# EAGLE schematic TommyPROM-uno (EAGLE 9.3.0)
Tom's EEPROM programmer hosted on Arduino Uno.
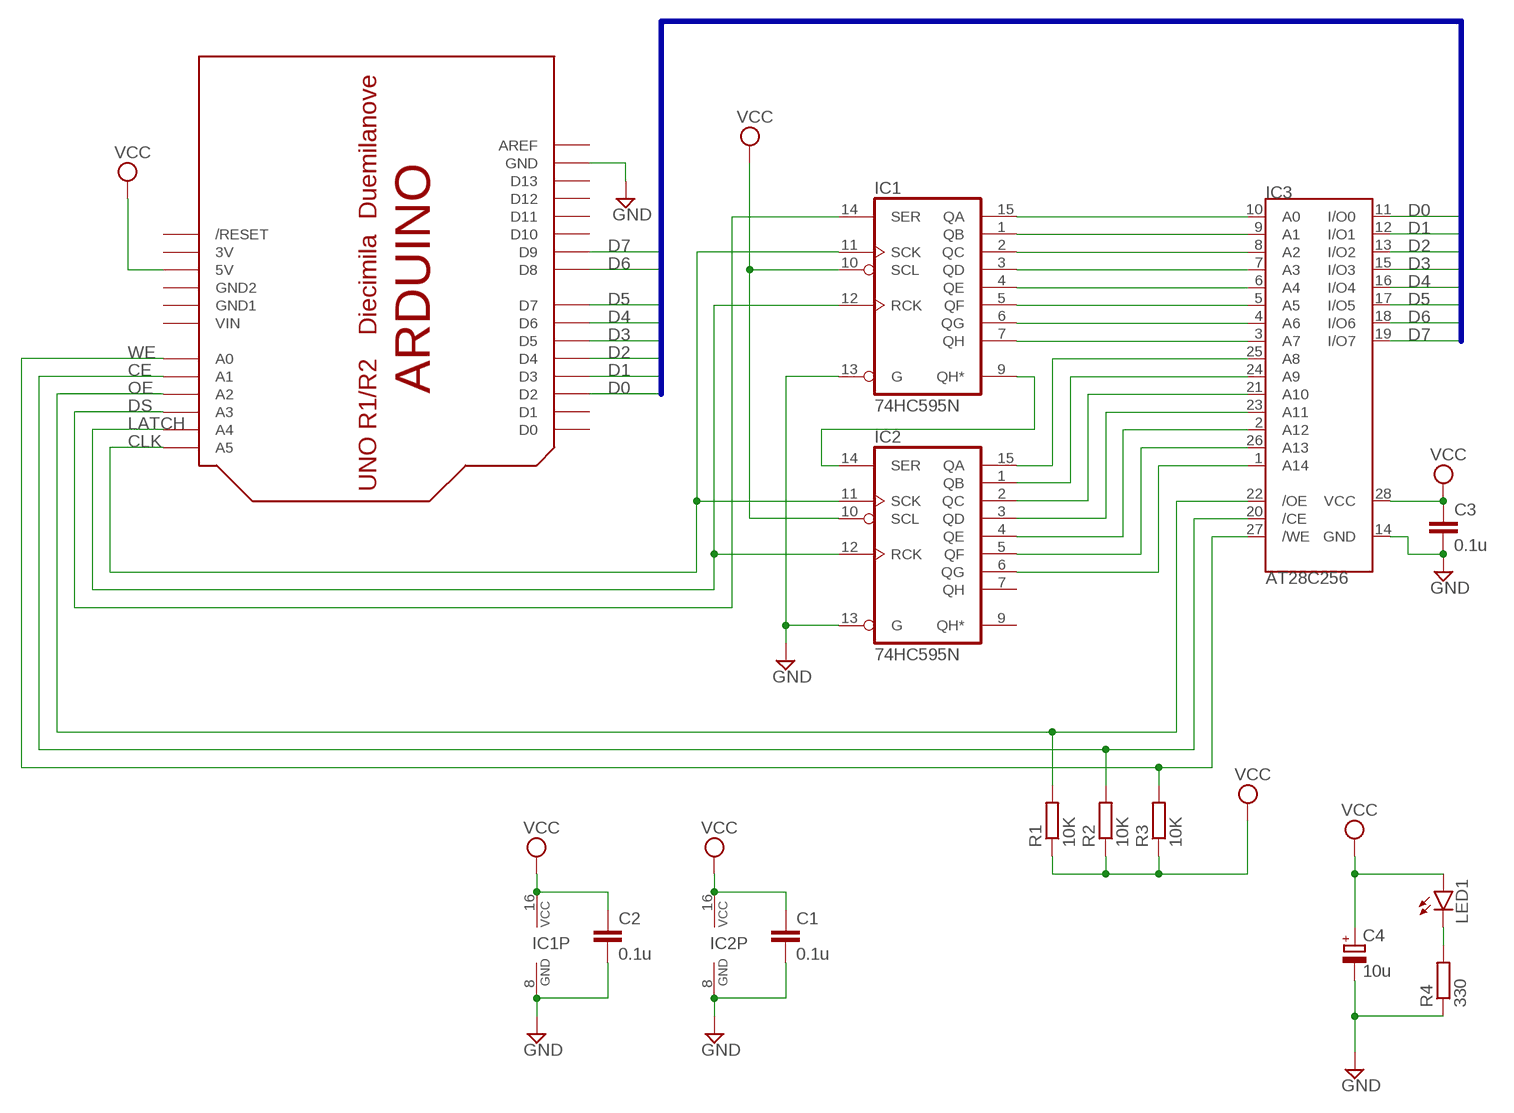
[diagram p0: schematic, sheet 1]

## Parts
C1  0.1u  C-EU025-025X050  [C025-025X050]
C2  0.1u  C-EU025-025X050  [C025-025X050]
C3  0.1u  C-EU025-025X050  [C025-025X050]
C4  10u  CPOL-EUE2-5  [E2-5]
IC1  74HC595N  [DIL16]
IC2  74HC595N  [DIL16]
IC3  AT28C256  AT28C256-28DIP  [DIL28-6]
LED1  LED5MM  [LED5MM]
R1  10K  R-EU_0204/7  [0204/7]
R2  10K  R-EU_0204/7  [0204/7]
R3  10K  R-EU_0204/7  [0204/7]
R4  330  R-EU_0204/7  [0204/7]
U$1  ARDUINO-BPLACE  [ARDUINO-BPLACE]

## Nets
CE: IC3.20(/CE) R2.2 U$1.A1
CLK: IC1.11(SCK) IC2.11(SCK) U$1.A5
D0: IC3.11(I/O0) U$1.D2
D1: IC3.12(I/O1) U$1.D3
D2: IC3.13(I/O2) U$1.D4
D3: IC3.15(I/O3) U$1.D5
D4: IC3.16(I/O4) U$1.D6
D5: IC3.17(I/O5) U$1.D7
D6: IC3.18(I/O6) U$1.D8
D7: IC3.19(I/O7) U$1.D9
DS: IC1.14(SER) U$1.A3
GND: C1.2 C2.2 C3.2 C4.- IC1.8(GND) IC1.13(G) IC2.8(GND) IC2.13(G) IC3.14(GND) R4.1 U$1.GND
LATCH: IC1.12(RCK) IC2.12(RCK) U$1.A4
N$1: IC1.9(QH*) IC2.14(SER)
N$2: LED1.K(C) R4.2
N$6: IC2.6(QG) IC3.1(A14)
N$7: IC2.5(QF) IC3.26(A13)
N$8: IC2.4(QE) IC3.2(A12)
N$9: IC2.3(QD) IC3.23(A11)
N$10: IC2.2(QC) IC3.21(A10)
N$15: IC2.1(QB) IC3.24(A9)
N$16: IC2.15(QA) IC3.25(A8)
N$17: IC1.7(QH) IC3.3(A7)
N$18: IC1.6(QG) IC3.4(A6)
N$19: IC1.5(QF) IC3.5(A5)
N$20: IC1.4(QE) IC3.6(A4)
N$21: IC1.3(QD) IC3.7(A3)
N$22: IC1.2(QC) IC3.8(A2)
N$23: IC1.1(QB) IC3.9(A1)
N$24: IC1.15(QA) IC3.10(A0)
OE: IC3.22(/OE) R1.2 U$1.A2
VCC: C1.1 C2.1 C3.1 C4.+ IC1.10(SCL) IC1.16(VCC) IC2.10(SCL) IC2.16(VCC) IC3.28(VCC) LED1.A R1.1 R2.1 R3.1 U$1.5V
WE: IC3.27(/WE) R3.2 U$1.A0
Unconnected: IC2.7(QH) IC2.9(QH*) U$1.AREF U$1.D0 U$1.D1 U$1.D10 U$1.D11 U$1.D12 U$1.D13 U$1.RESET(/RESET)

## Buses
D[0..7]

## Power pins joined to a net without a drawn wire
3V: U$1.3V
GND1: U$1.GND1
GND2: U$1.GND2
VIN: U$1.VIN

## Library data of the parts
C1-C3 = rcl:C-EU: CAPACITOR, European symbol; SPICEPREFIX: C
C4 = rcl:CPOL-EU: POLARIZED CAPACITOR, European symbol; SPICEPREFIX: C
IC1 IC2 = 74xx-eu:74*595: 8-bit SHIFT REGISTER, output latch
IC3 = mylib_memory:AT28C256-28DIP: IC EEPROM 256KBIT 28DIP
LED1 = led:LED: LED OSRAM: - CHIPLED LG R971, LG N971, LY N971, LG Q971, LY Q971, LO R971, LY R971 LH N974, LH R974 LS Q976, LO Q976, LY Q976 LO Q996 - Hyper CHIPLED LW Q18S LB Q993, LB Q99A, LB R99A - SideLED LS A670, LO A670, LY A670, LG A670, LP A670 LB A673, LV A673, LT A673, LW A673 LH A674 LY A675 LS A676, LA A676, LO A676, LY A676, LW A676 LS A679, LY A679, LG A679 - Hyper Micro SIDELED® LS Y876, LA Y876, LO Y876, LY Y876 LT Y87S - SmartLED LW L88C, LW L88S LB L89C, LB L89S, LG L890 LS L89K, LO L89K, LY L89K LS L896, LA L896, LO L896, LY L896 - TOPLED LS T670, LO T670, LY T670, LG T670, LP T670 LSG T670, LSP T670, LSY T670, LOP T670, LYG T670 LG T671, LOG T671, LSG T671 LB T673, LV T673, LT T673, LW T673 LH T674 LS T676, LA T676, LO T676, LY T676, LB T676, LH T676, LSB T676, LW T676 LB T67C, LV T67C, LT T67C, LS T67K, LO T67K, LY T67K, LW E67C LS E67B, LA E67B, LO E67B, LY E67B, LB E67C, LV E67C, LT E67C LW T67C LS T679, LY T679, LG T679 LS T770, LO T770, LY T770, LG T770, LP T770 LB T773, LV T773, LT T773, LW T773 LH T774 LS E675, LA E675, LY E675, LS T675 LS T776, LA T776, LO T776, LY T776, LB T776 LHGB T686 LT T68C, LB T68C - Hyper Mini TOPLED® LB M676 - Mini TOPLED Santana® LG M470 LS M47K, LO M47K, LY M47K Source: http://www.osram.convergy.de LUXEON: - LUMILED® LXK2-PW12-R00, LXK2-PW12-S00, LXK2-PW14-U00, LXK2-PW14-V00 LXK2-PM12-R00, LXK2-PM12-S00, LXK2-PM14-U00 LXK2-PE12-Q00, LXK2-PE12-R00, LXK2-PE12-S00, LXK2-PE14-T00, LXK2-PE14-U00 LXK2-PB12-K00, LXK2-PB12-L00, LXK2-PB12-M00, LXK2-PB14-N00, LXK2-PB14-P00, LXK2-PB14-Q00 LXK2-PR12-L00, LXK2-PR12-M00, LXK2-PR14-Q00, LXK2-PR14-R00 LXK2-PD12-Q00, LXK2-PD12-R00, LXK2-PD12-S00 LXK2-PH12-R00, LXK2-PH12-S00 LXK2-PL12-P00, LXK2-PL12-Q00, LXK2-PL12-R00 Source: www.luxeon.com KINGBRIGHT: KA-3528ASYC Source: www.kingbright.com
R1-R4 = rcl:R-EU_: RESISTOR, European symbol; SPICEPREFIX: R
U$1 = adafruit:ARDUINO: Arduino Diecimila/Duemilanove Make a shield with ease, this package has all the named pins as well as the two mounting drill holes and an outline of the USB and DC power connector. The outline is on the DIMENSION layer, so if your board house uses it they will cut the outline to match. http://www.ladyada.net/library/pcb/eaglelibrary.html